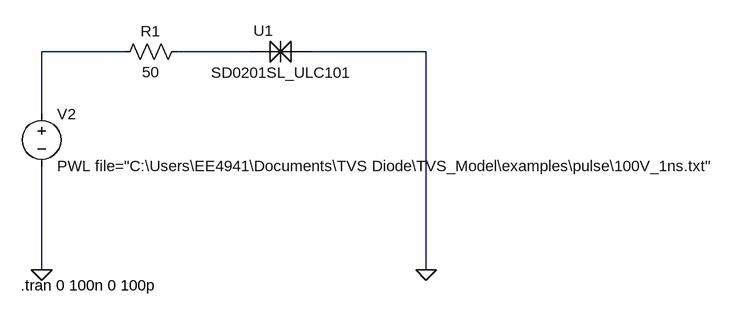
[diagram p0: schematic example2.asc]
example2.asc, the LTspice schematic file:
Version 4
SHEET 1 1100 680
WIRE 64 -224 -64 -224
WIRE 256 -224 144 -224
WIRE 528 -224 352 -224
WIRE -64 -128 -64 -224
WIRE -64 112 -64 -48
WIRE 528 112 528 -224
FLAG -64 112 0
FLAG 528 112 0
SYMBOL voltage -64 -144 R0
WINDOW 123 0 0 Left 0
WINDOW 39 0 0 Left 0
SYMATTR InstName V2
SYMATTR Value PWL file="C:\Users\EE4941\Documents\TVS Diode\TVS_Model\examples\pulse\100V_1ns.txt"
SYMBOL TDK\\TVS 304 -224 R0
SYMATTR InstName U1
SYMBOL res 160 -240 R90
WINDOW 0 0 56 VBottom 2
WINDOW 3 32 56 VTop 2
SYMATTR InstName R1
SYMATTR Value 50
TEXT -96 136 Left 2 !.tran 0 100n 0 100p

The netlist it stands for:
* example2.asc
V2 N001 0 PWL file="C:\Users\EE4941\Documents\TVS Diode\TVS_Model\examples\pulse\100V_1ns.txt"
XU1 N002 0 SD0201SL_ULC101  ; pins P1 P2
R1 N002 N001 50
.tran 0 100n 0 100p
.lib TVS.sub
.backanno
.end